# EAGLE design PDM_v1 (EAGLE 7.5.0)
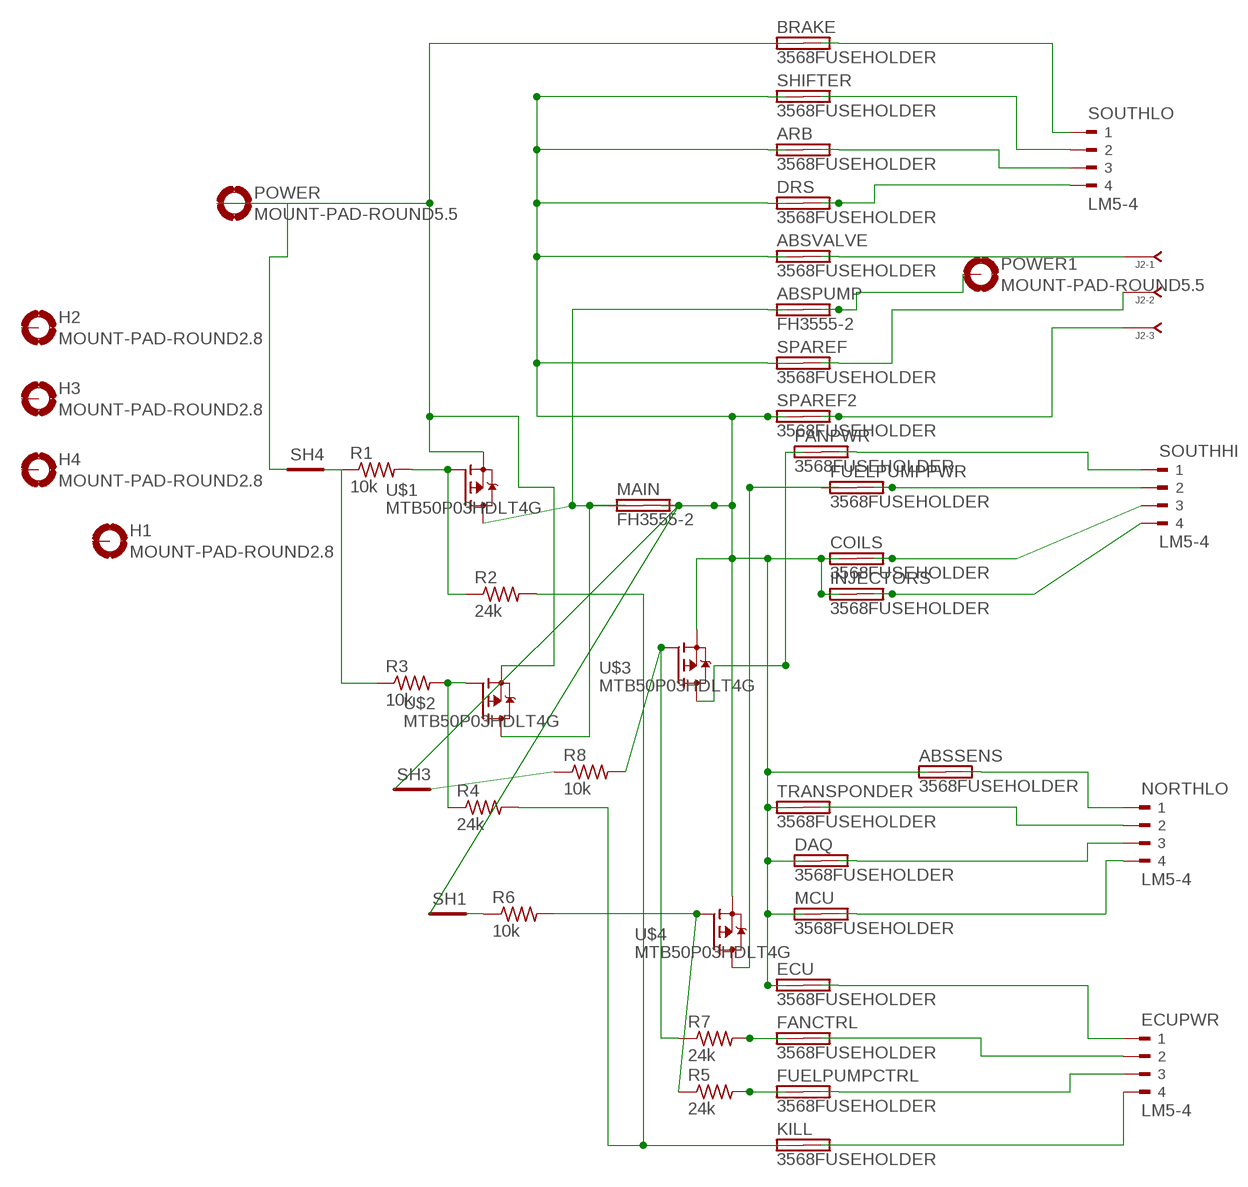
[diagram p0: schematic, sheet 1]

## Parts
ABSPUMP  FH3555-2  [3555-2]
ABSSENS  3568FUSEHOLDER  [3568]
ABSVALVE  3568FUSEHOLDER  [3568]
ARB  3568FUSEHOLDER  [3568]
BRAKE  3568FUSEHOLDER  [3568]
COILS  3568FUSEHOLDER  [3568]
DAQ  3568FUSEHOLDER  [3568]
DRS  3568FUSEHOLDER  [3568]
ECU  3568FUSEHOLDER  [3568]
ECUPWR  LM5-4  [281-1423]
FANCTRL  3568FUSEHOLDER  [3568]
FANPWR  3568FUSEHOLDER  [3568]
FUELPUMPCTRL  3568FUSEHOLDER  [3568]
FUELPUMPPWR  3568FUSEHOLDER  [3568]
H1  MOUNT-PAD-ROUND2.8  [2,8-PAD]
H2  MOUNT-PAD-ROUND2.8  [2,8-PAD]
H3  MOUNT-PAD-ROUND2.8  [2,8-PAD]
H4  MOUNT-PAD-ROUND2.8  [2,8-PAD]
INJECTORS  3568FUSEHOLDER  [3568]
J2  J-04-  [535512-04]
KILL  3568FUSEHOLDER  [3568]
MAIN  FH3555-2  [3555-2]
MCU  3568FUSEHOLDER  [3568]
NORTHLO  LM5-4  [281-1423]
POWER  MOUNT-PAD-ROUND5.5  [5,5-PAD]
POWER1  MOUNT-PAD-ROUND5.5  [5,5-PAD]
R1  10k  R-US_M0805  [M0805]
R2  24k  R-US_M0805  [M0805]
R3  10k  R-US_M0805  [M0805]
R4  24k  R-US_M0805  [M0805]
R5  24k  R-US_M0805  [M0805]
R6  10k  R-US_M0805  [M0805]
R7  24k  R-US_M0805  [M0805]
R8  10k  R-US_M0805  [M0805]
SH1  SHORTA5  [SHORT_ALL-50]
SH3  SHORTA5  [SHORT_ALL-50]
SH4  SHORTA5  [SHORT_ALL-50]
SHIFTER  3568FUSEHOLDER  [3568]
SOUTHHI  LM5-4  [281-1423]
SOUTHLO  LM5-4  [281-1423]
SPAREF  3568FUSEHOLDER  [3568]
SPAREF2  3568FUSEHOLDER  [3568]
TRANSPONDER  3568FUSEHOLDER  [3568]
U$1  MTB50P03HDLT4G  [TO263]
U$2  MTB50P03HDLT4G  [TO263]
U$3  MTB50P03HDLT4G  [TO263]
U$4  MTB50P03HDLT4G  [TO263]

## Nets
+12V [30Rail]: BRAKE.L1(1A) BRAKE.L2(1B) POWER.B5,5(MOUNT) SH4.1 U$1.2(S) U$2.2(S)
MAINRAIL: ABSSENS.L1(1A) ABSSENS.L2(1B) ABSVALVE.L1(1A) ABSVALVE.L2(1B) ARB.L1(1A) ARB.L2(1B) COILS.L1(1A) COILS.L2(1B) DAQ.L1(1A) DAQ.L2(1B) DRS.L1(1A) DRS.L2(1B) ECU.L1(1A) ECU.L2(1B) INJECTORS.L1(1A) INJECTORS.L2(1B) MAIN.R1(2A) MAIN.R2(2B) MCU.L1(1A) MCU.L2(1B) SH1.1 SH3.1 SHIFTER.L1(1A) SHIFTER.L2(1B) SPAREF2.L1(1A) SPAREF2.L2(1B) SPAREF.L1(1A) SPAREF.L2(1B) TRANSPONDER.L1(1A) TRANSPONDER.L2(1B) U$3.2(S) U$4.2(S)
N$1: INJECTORS.R1(2A) INJECTORS.R2(2B) SOUTHHI.P$4
N$2 [HIGH RAIL]: ABSPUMP.L1(1A) ABSPUMP.L2(1B) MAIN.L1(1A) MAIN.L2(1B) U$1.3(D) U$2.3(D)
N$3 [SIG]: R3.2 R4.1 U$2.1(G)
N$4: FUELPUMPPWR.R1(2A) FUELPUMPPWR.R2(2B) SOUTHHI.P$2
N$5 [SIG]: KILL.L1(1A) KILL.L2(1B) R2.2 R4.2
N$6: ECU.R1(2A) ECU.R2(2B) ECUPWR.P$1
N$9 [HIGH RAIL]: ABSPUMP.R1(2A) ABSPUMP.R2(2B) POWER1.B5,5(MOUNT)
N$10 [SIG]: ECUPWR.P$2 FANCTRL.R1(2A) FANCTRL.R2(2B)
N$11: ABSVALVE.R1(2A) ABSVALVE.R2(2B) J2.LEFT
N$12: BRAKE.R1(2A) BRAKE.R2(2B) SOUTHLO.P$1
N$13 [SIG]: FANCTRL.L1(1A) FANCTRL.L2(1B) R7.2
N$14: SHIFTER.R1(2A) SHIFTER.R2(2B) SOUTHLO.P$2
N$15: COILS.R1(2A) COILS.R2(2B) SOUTHHI.P$3
N$16: ABSSENS.R1(2A) ABSSENS.R2(2B) NORTHLO.P$1
N$17: NORTHLO.P$2 TRANSPONDER.R1(2A) TRANSPONDER.R2(2B)
N$18: DAQ.R1(2A) DAQ.R2(2B) NORTHLO.P$3
N$19: MCU.R1(2A) MCU.R2(2B) NORTHLO.P$4
N$20 [SIG]: ECUPWR.P$3 FUELPUMPCTRL.R1(2A) FUELPUMPCTRL.R2(2B)
N$21 [SIG]: ECUPWR.P$4 KILL.R1(2A) KILL.R2(2B)
N$22: ARB.R1(2A) ARB.R2(2B) SOUTHLO.P$3
N$23: DRS.R1(2A) DRS.R2(2B) SOUTHLO.P$4
N$24 [SIG]: R1.2 R2.1 U$1.1(G)
N$25 [SIG]: R5.1 R6.2 U$4.1(G)
N$26: J2.MIDDLE SPAREF.R1(2A) SPAREF.R2(2B)
N$27: J2.RIGHT SPAREF2.R1(2A) SPAREF2.R2(2B)
N$28: FUELPUMPPWR.L1(1A) FUELPUMPPWR.L2(1B) U$4.3(D)
N$29: FANPWR.R1(2A) FANPWR.R2(2B) SOUTHHI.P$1
N$30 [SIG]: R7.1 R8.2 U$3.1(G)
N$31 [SIG]: FUELPUMPCTRL.L1(1A) FUELPUMPCTRL.L2(1B) R5.2
N$32 [SIG]: R1.1 R3.1 SH4.2
N$33 [SIG]: R8.1 SH3.2
N$34: FANPWR.L1(1A) FANPWR.L2(1B) U$3.3(D)
N$35 [SIG]: R6.1 SH1.2
Unconnected: H1.B2,8(MOUNT) H2.B2,8(MOUNT) H3.B2,8(MOUNT) H4.B2,8(MOUNT)

## Library data of the parts
ABSPUMP MAIN = fuse:FH3555-2
ABSSENS ABSVALVE ARB BRAKE COILS DAQ DRS ECU FANCTRL FANPWR FUELPUMPCTRL FUELPUMPPWR INJECTORS KILL MCU SHIFTER SPAREF SPAREF2 TRANSPONDER = fuse:3568FUSEHOLDER: 3568 20AMP 500VAC
ECUPWR NORTHLO SOUTHHI SOUTHLO = con-weidmueller-sl35:LM5-4
H1-H4 POWER POWER1 = holes:MOUNT-PAD-ROUND: MOUNTING PAD, round
J2 = 3pincon:J-04-: HEADER JACK PINS
R1-R8 = adafruit:R-US_: RESISTOR, American symbol
SH1 SH3 SH4 = shorts:SHORT: Short between two nets; BOM: no
U$1-U$4 = transistor-fet:MTB50P03HDLT4G

## Net classes
0 LO RAIL: width 4.24 mm, drill 0.5 mm, clearance 0.2 mm
1 HIGH RAIL: width 9.55 mm, drill 0.5 mm, clearance 0.2 mm
2 SIG: width 0.13 mm, drill 0.5 mm, clearance 0.2 mm
3 30Rail: width 5.2 mm, drill 0.5 mm, clearance 0.2 mm

## Board
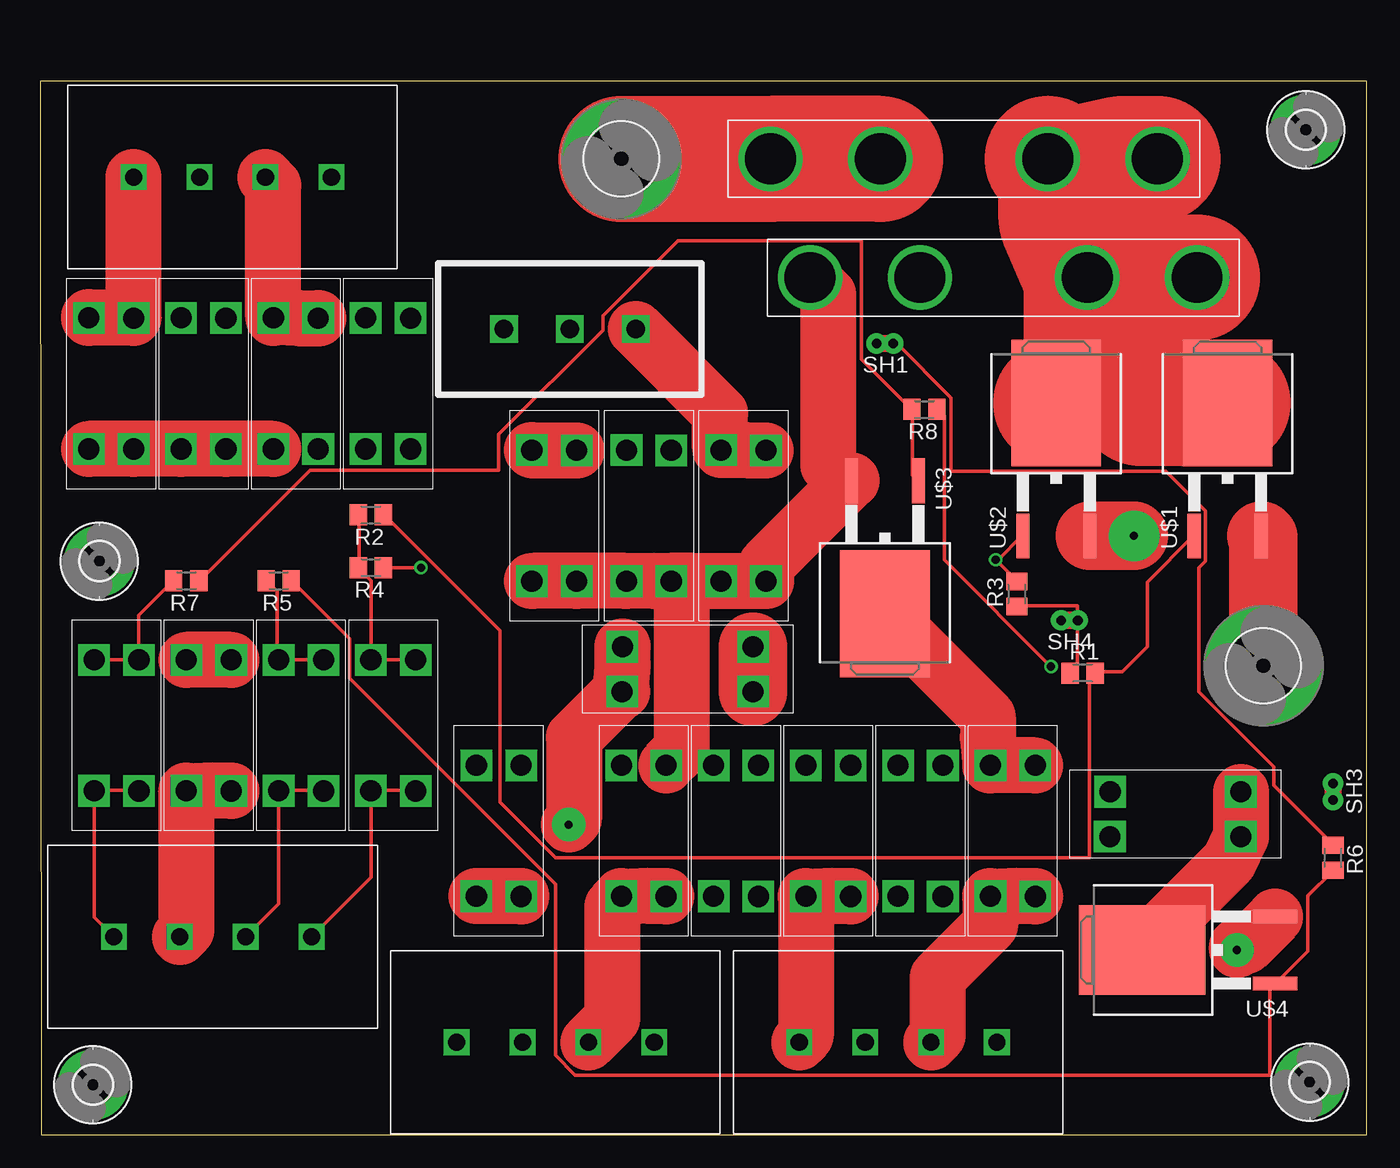
[diagram p1: board, top side]
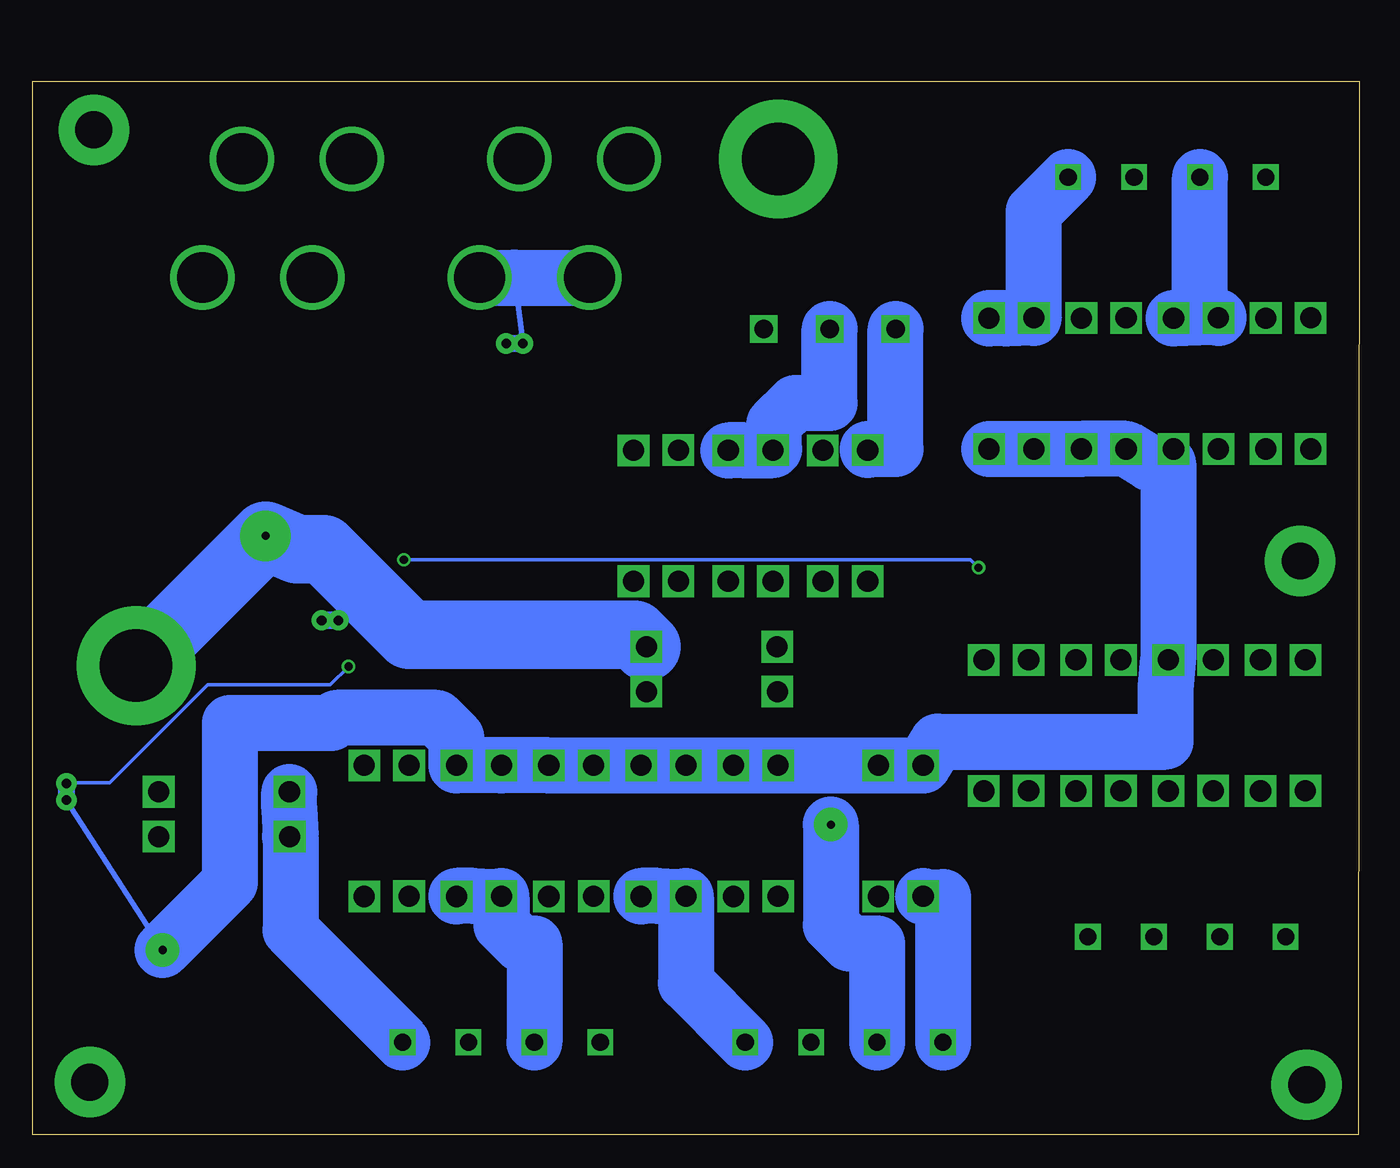
[diagram p2: board, bottom side, seen from below]

Size 100.64 x 79.9 mm. Coordinates in mm from the lower left corner, seen from the top.
Outline: 0.1,0 100.64,0 100.64,79.9 0,79.9 0.1,0
Copper layers (1*16): Top 0.035mm / dielectric 1.5mm / Bottom 0.035mm
Design rules "default": minimum track width 10mil, minimum drill 24mil, track to track 8mil, track to pad 8mil, pad to pad 8mil, via to via 8mil, smd to smd 8mil, copper to edge 40mil, drill to drill 8mil, minimum pad ring 10mil, minimum via ring 8mil, stop-mask expansion 4mil, vias tented up to drill 0mil, thermal gap 10mil

### Footprints (pad centres in the part's own frame; a part is rotated, then mirrored left to right if it is on the bottom)
3555-2 = drill 3.86: L1 -14.68,0; L2 -6.35,0; R1 6.35,0; R2 14.68,0
3568 = drill 1.6 square: L1 0,3.4; L2 0,0; R1 9.94,3.4; R2 9.92,0
281-1423 = drill 1.3 square: P$1 -2.5,0; P$2 -7.5,0; P$3 2.5,0; P$4 7.5,0
2,8-PAD = drill 2.8 pad 5.334: B2,8 0,0
535512-04 = drill 1.4 square: LEFT -5,0; MIDDLE 0,0; RIGHT 5,0
5,5-PAD = drill 5.5 pad 9: B5,5 0,0
M0805 = smd 1.3 x 1.6: 1 -0.95,0; 2 0.95,0
SHORT_ALL-50 = drill 0.737 pad 1.524: 1 -0.635,0; 2 0.635,0
TO263 = smd 1 x 3.4: 1 -2.54,-6.6; 2 2.54,-6.6 | smd 6.8 x 9.6: 3 0,3.5

### Placement (x,y rotation side)
ABSPUMP  70.1,74 180 top
ABSSENS  14.1,52 90 top
ABSVALVE  55.07,41.97 90 top
ARB  44.1,28 270 top
BRAKE  54.1,37 180 top
COILS  65.1,28 270 top
DAQ  21.1,52 90 top
DRS  51.1,28 270 top
ECU  11.1,36 270 top
ECUPWR  13.1,15 0 top
FANCTRL  4.1,36 270 top
FANPWR  72.1,28 270 top
FUELPUMPCTRL  18.1,36 270 top
FUELPUMPPWR  91.1,26 180 top
H1  4.5,43.5 0 top
H2  4.01,3.78 0 top
H3  96.32,3.98 0 top
H4  96.02,76.2 0 top
INJECTORS  58.1,28 270 top
J2  40.2,61.1 180 top
KILL  25.1,36 270 top
MAIN  73.1,65 180 top
MCU  28.1,52 90 top
NORTHLO  14.6,72.62 0 top
POWER  92.81,35.56 0 top
POWER1  44.1,74 0 top
R1  79.1,35 0 top
R2  25.1,47 180 top
R3  74.1,41 90 top
R4  25.1,43 180 top
R5  18.1,42 180 top
R6  98.1,21 270 top
R7  11.1,42 180 top
R8  67.1,55 180 top
SH1  64.1,60 0 top
SH3  98.1,26 90 top
SH4  78.1,39 0 top
SHIFTER  33.1,28 270 top
SOUTHHI  65.1,7 180 top
SOUTHLO  39.1,7 0 top
SPAREF  47.89,41.97 90 top
SPAREF2  40.71,41.97 90 top
TRANSPONDER  7.1,52 90 top
U$1  90.1,52 0 top
U$2  77.1,52 0 top
U$3  64.1,43 180 top
U$4  87.1,14 90 top

### Tracks (layer width: path | path; a pad name or v marks a point on that pad's centre or on a via)
+12V  (via drill 0.61 pad 3.81)
  Top 5.2: BRAKE.L2 BRAKE.L1 | v83,45.4 U$2.2 | U$1.2 92.7,45.4 92.8,45.3 92.8,35.6 POWER.B5,5
  Bottom 0.406: SH4.1 74.15,39.95
  Bottom 5.2: POWER.B5,5 92.8,35.6 v83,45.4 80.6,44.4 78.6,44.4 74.15,39.95 72.1,37.9 55,37.9 BRAKE.L2
MAINRAIL  (via drill 0.61 pad 2.54)
  Top 4.24: 40.7,42 37.4,42 SPAREF2.L1 | 40.7,42 SPAREF2.L2 | 40.7,42 44.4,42 SPAREF.L1 46.6,42 47.8,42 | 47.8,42 SPAREF.L2 | 61.25,49.35 55.1,43.2 55.1,42 | 61.25,49.35 61.5,49.6 U$3.2 | 55.1,42 ABSVALVE.L2 | 51.7,42 ABSVALVE.L1 | 51.7,42 55.1,42 | 48.7,42 49.6,42 51.7,42 | 48.7,42 47.8,42 | MAIN.R2 58.5,65 59.8,63.7 59.8,50.8 61.25,49.35 | ECU.L1 ECU.L2 | TRANSPONDER.L1 TRANSPONDER.L2 ABSSENS.L1 ABSSENS.L2 DAQ.L1 | v90.8,14 90.8,14.3 91.5,14.3 93.7,16.5 U$4.2 | 48.7,42 48.7,29.2 ARB.L1
  Bottom 0.406: SH3.1 v90.8,14 | SH1.1 64.1,65
  Bottom 4.24: MAIN.R1 64.1,65 MAIN.R2 | MCU.L2 MCU.L1 DAQ.L2 DAQ.L1 15.9,50.9 14.5,50.9 ECU.L1 14.7,33.9 14.7,29.8 32,29.8 SHIFTER.L2 SHIFTER.L1 ARB.L2 ARB.L1 DRS.L2 DRS.L1 INJECTORS.L2 INJECTORS.L1 COILS.L2 COILS.L1 68.5,30.1 70,31.6 77.6,31.6 78,31.2 85.7,31.2 85.7,19.1 v90.8,14
N$1
  Top 4.24: SOUTHHI.P$4 58.1,7.5 58.1,18 | 58.1,18 INJECTORS.R2 | INJECTORS.R1 61.5,18.1 60.2,18.1 58.1,18
N$2
  Top 9.55: 79.4,57.8 U$2.3 | 79.4,65 79.4,57.8 | 79.4,65 MAIN.L2 MAIN.L1 | U$1.3 83.5,55.5 79.4,57.8 | 77.5,73 76.5,74 ABSPUMP.L2 | 77.5,73 77.5,69.4 79.4,65 | ABSPUMP.L1 82.1,74 77.5,73
N$3  (via drill 0.61)
  Top 0.254: v28.9,43 R4.1 | R3.2 74.1,42 v72.5,43.6 72.7,43.5 72.7,43.6 74.5,45.4 U$2.1
  Bottom 0.254: v28.9,43 29.5,43.6 v72.5,43.6
N$4
  Bottom 4.24: SOUTHHI.P$2 81.1,15.5 81.1,22.6 | 81.1,22.6 FUELPUMPPWR.R1 | FUELPUMPPWR.R2 81.2,26 81.2,24.7 81.1,22.6
N$5
  Top 0.254: R2.2 24.2,47 24.2,43 R4.2 24.2,42.9 25.1,42 KILL.L2 KILL.L1
N$6
  Top 4.24: ECUPWR.P$1 11.1,15.5 11.1,26 | 11.1,26 ECU.R2 | ECU.R1 14.5,26.1 13.2,26.1 11.1,26
N$9
  Top 9.55: ABSPUMP.R1 ABSPUMP.R2 POWER1.B5,5
N$10
  Top 0.254: ECUPWR.P$2 4.1,16.5 FANCTRL.R2 4.2,26.1 7.5,26.1 FANCTRL.R1
N$11
  Top 4.24: J2.LEFT 51.6,54.7 51.6,52 ABSVALVE.R1 53.8,51.9 55,51.9 ABSVALVE.R2
N$12  (via drill 0.61 pad 2.54)
  Top 4.24: v40.1,23.5 40.5,23.9 40.5,30.1 44,33.6 | BRAKE.R1 44,33.6 | BRAKE.R2 44.2,37 44.2,35.7 44,33.6
  Bottom 4.24: SOUTHLO.P$1 36.6,14.5 38.7,14.5 40.1,15.9 v40.1,23.5
N$13
  Top 0.254: R7.2 10.1,42 7.5,39.4 FANCTRL.L1 FANCTRL.L2
N$14
  Top 4.24: SHIFTER.R1 36.5,18.1 33.1,18.1 SHIFTER.R2
  Bottom 4.24: SOUTHLO.P$2 31.6,18 33.1,18 SHIFTER.R2
N$15
  Bottom 4.24: SOUTHHI.P$3 62.6,14.5 63.7,14.5 65.1,15.9 65.1,18 | 65.1,18 COILS.R2 | COILS.R1 68.5,18.1 67.2,18.1 65.1,18
N$16
  Bottom 4.24: 12.1,62 NORTHLO.P$1 | 12.1,62 10.7,62 ABSSENS.R1 | ABSSENS.R2 14.1,61.9 12.1,62
N$17
  Top 4.24: 7.1,62 NORTHLO.P$2 | 7.1,62 TRANSPONDER.R2 | TRANSPONDER.R1 3.7,62 7.1,62
N$18
  Top 4.24: 17.7,62 17.7,72 17.1,72.6 NORTHLO.P$3 | 17.7,62 DAQ.R1 | DAQ.R2 21.1,61.9 19.8,61.9 17.7,62
N$19
  Bottom 4.24: 24.7,62 24.7,70 22.1,72.6 NORTHLO.P$4 | 24.7,62 MCU.R1 | MCU.R2 28.1,61.9 26.8,61.9 24.7,62
N$20
  Top 0.254: ECUPWR.P$3 18.1,17.5 FUELPUMPCTRL.R2 18.2,26.1 21.5,26.1 FUELPUMPCTRL.R1
N$21
  Top 0.254: ECUPWR.P$4 25.1,19.5 KILL.R2 25.2,26.1 28.5,26.1 KILL.R1
N$22
  Top 4.24: SOUTHLO.P$3 43.4,8.8 43.4,17.3 44.1,18 | 44.1,18 ARB.R2 | ARB.R1 47.5,18.1 46.2,18.1 44.1,18
N$23
  Bottom 4.24: SOUTHLO.P$4 51.1,11.5 51.1,18 | 51.1,18 DRS.R2 | DRS.R1 54.5,18.1 53.2,18.1 51.1,18
N$24
  Top 0.254: R2.1 26.1,47 34.9,38.2 34.9,25.2 39.1,21 79.6,21 79.6,34.6 80,35 R1.2 80.1,35.1 82.1,35.1 84,37 84,41.9 87.5,45.4 U$1.1
N$25
  Top 0.254: R5.1 19.1,42 23.5,37.6 23.5,34.6 39.1,19 39.1,6 40.6,4.5 93.3,4.5 93.3,11 93.7,11.4 U$4.1 93.8,11.5 96.2,13.9 96.2,18.1 98.1,20 R6.2
N$26
  Bottom 4.24: J2.MIDDLE 40.2,55.5 42.8,55.5 44.4,53.9 44.4,52 SPAREF.R1 46.6,51.9 47.8,51.9 SPAREF.R2
N$27
  Top 4.24: SPAREF2.R2 37.4,51.9 SPAREF2.R1
  Bottom 4.24: J2.RIGHT 35.2,52 37.3,52 SPAREF2.R1
N$28
  Top 4.24: FUELPUMPPWR.L2 FUELPUMPPWR.L1 90.2,20.7 83.6,14.1 U$4.3
N$29
  Top 4.24: SOUTHHI.P$1 68.1,7.5 68.1,11.9 72.1,15.9 72.1,18 | 72.1,18 FANPWR.R2 | FANPWR.R1 75.5,18.1 74.2,18.1 72.1,18
N$30
  Top 0.254: R7.1 12.1,42 20.5,50.4 34.8,50.4 34.8,53.1 42.7,61 42.7,62.1 48.4,67.8 62.3,67.8 62.3,58.8 66.1,55 R8.2 66.2,54.9 66.2,50 66.6,49.6 U$3.1
N$31
  Top 0.254: R5.2 17.2,42 18,41.2 18,36.1 FUELPUMPCTRL.L2 FUELPUMPCTRL.L1
N$32
  Top 0.254: R1.1 78.2,35 78.7,35.5 78.7,39 SH4.2 78.7,39.1 78.7,40.1 74.1,40.1 R3.1
N$33  (via drill 0.61)
  Top 0.254: v76.7,35.5 68.6,43.6 68.6,54.5 68.1,55 R8.1
  Bottom 0.254: v76.7,35.5 78.1,34.1 87.4,34.1 94.8,26.7 98.1,26.7 SH3.2
N$34
  Top 4.24: FANPWR.L1 FANPWR.L2 71.9,30.1 71.9,31.7 U$3.3
N$35
  Top 0.254: SH1.2 65,60 69.1,55.9 69.1,50.3 85.4,50.3 88.4,47.3 88.4,43.5 87.9,43 87.9,33.6 93.6,27.9 93.6,26.5 98.1,22 R6.1